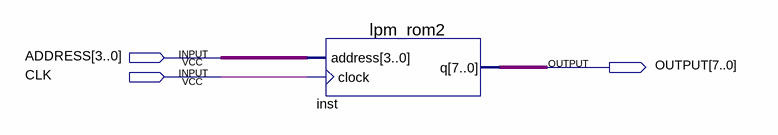
[diagram p0: schematic sheet]
// Quartus schematic DECODER.bdf as structural Verilog: 1 symbols, 3 pins
module DECODER (
  input  [3:0] ADDRESS,
  input  CLK,
  output [7:0] OUTPUT
);

  lpm_rom2 inst (.address(ADDRESS), .clock(CLK), .q(OUTPUT));
endmodule
